# Altium schematic sheet LevelShift.SchDoc
size A; SheetNumber: 2; SheetTotal: 1
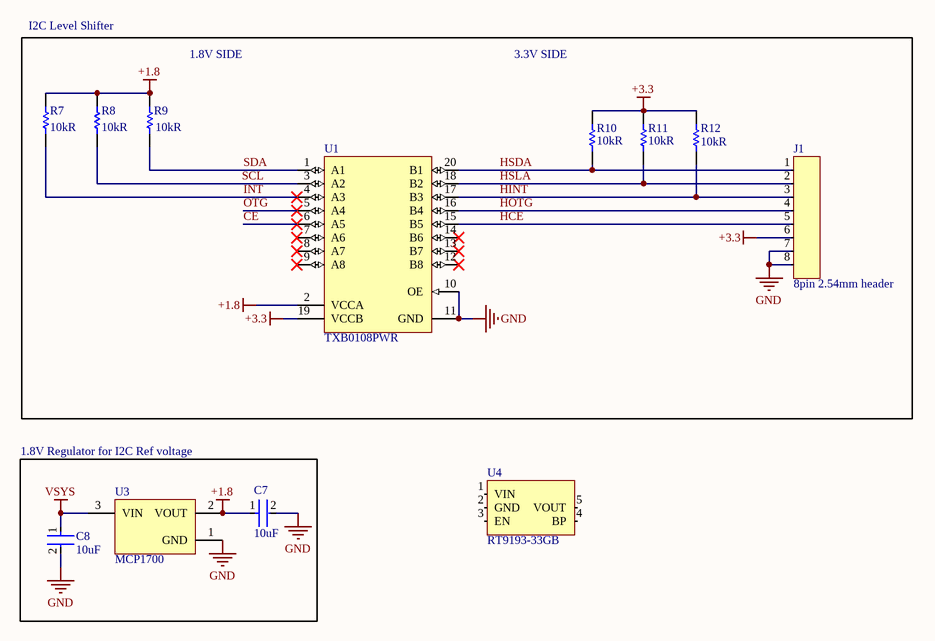
[diagram p0: LevelShift.SchDoc]

## Parts
C7  value 10uF  [FP-C0805C-DG-MFG]  (hidden comment: C0805C106K8PACTU)
C8  value 10uF  [FP-C0805C-DG-MFG]  (hidden comment: C0805C106K8PACTU)
J1  8pin 2.54mm header  [8pin 2.54mm header]
R7  value 10kR  [RESC2013X60X35NL10T20]  (hidden comment: RC0805FR-0710KL)
R8  value 10kR  [RESC2013X60X35NL10T20]  (hidden comment: RC0805FR-0710KL)
R9  value 10kR  [RESC2013X60X35NL10T20]  (hidden comment: RC0805FR-0710KL)
R10  value 10kR  [RESC2013X60X35NL10T20]  (hidden comment: RC0805FR-0710KL)
R11  value 10kR  [RESC2013X60X35NL10T20]  (hidden comment: RC0805FR-0710KL)
R12  value 10kR  [RESC2013X60X35NL10T20]  (hidden comment: RC0805FR-0710KL)
U1  TXB0108PWR  [PW0020A_L]
U3  MCP1700  [MCP1700-18]
U4  RT9193-33GB  [SOT-23-5]

## Blocks framed on the sheet
1.8V Regulator for I2C Ref voltage: C7 C8 U3

## Nets
+1.8: C7.1 R7.1 R8.1 R9.1 U1.2(VCCA) U3.2(VOUT)
+3.3: J1.6 R10.1 R11.1 R12.1 U1.19(VCCB)
GND: C7.2 C8.2 J1.7 J1.8 U1.10(OE) U1.11(GND) U3.1(GND)
VSYS: C8.1 U3.3(VIN)
CE: U1.6(A5)
HCE: J1.5 U1.15(B5)
HINT: J1.3 R12.2 U1.17(B3)
HOTG: J1.4 U1.16(B4)
HSDA: J1.1 R10.2 U1.20(B1)
HSLA: J1.2 R11.2 U1.18(B2)
INT: R7.2 U1.4(A3)
OTG: U1.5(A4)
SCL: R8.2 U1.3(A2)
SDA: R9.2 U1.1(A1)

Not connected (* = marked no-connect by the designer): U1 7(A6)* 8(A7)* 9(A8)* 12(B8)* 13(B7)* 14(B6)*; U4 1(VIN) 2(GND) 3(EN) 4(BP) 5(VOUT)

## Notes on the sheet
- I2C Level Shifter
- 1.8V SIDE
- 3.3V SIDE

## Library data of the parts
C7 C8 = CMP-2007-03243-2: CAP CER 10UF 10V X5R 0805; Manufacturer: Kemet; 3DS Part Number: 220-00001; Tolerance: 10%; Description: SMD Comm X5R, Ceramic, 10 uF, 10%, 10 V, X5R, SMD, MLCC, Temperature Stable, Class II, 0805; Temperature Coefficient: 15%; Material: Ceramic; Device Class L2: Capacitors; Device Class L1: Passive Components; ComponentLink2URL: https://content.kemet.com/datasheets/KEM_C1006_X5R_SMD.pdf; Height: 1.4mm; Lead Free: Yes; Manufacturer Part Number: C0805C106K8PACTU; Digikey Description: CAP CER 10UF 10V X5R 0805; Octopart: https://octopart.com/c0805c106k8pactu-kemet-98697; Capacitance: 10uF; Temperature Range Low: -55°C; Temperature: -55°C to +85°C; Automotive: No; Mouser Description: CAP CER 10UF 10V X5R 0805; Ipc Land Pattern Name: CAPC200125X125; Temperature Range High: +85°C; Voltage: 10V; RoHS: TRUE; Device Class L3: Ceramic Capacitors; ComponentLink2Description: Datasheet; Voltage Rating: 10V; Package: C0805C-DG; Temperature Characteristic: X5R; Category: Cap; LCSC: C15850
R7-R12 = CMP-1659-00013-4: Chip Resistor, 10 KOhm, +/- 1%, 0.125 W, -55 to 155 degC, 0805 (2012 Metric), RoHS, Tape and Reel; Manufacturer: Yageo; Voltage Rating: 150 V; Mount: Surface Mount; ComponentLink1Description: Manufacturer URL; ComponentLink2URL: http://www.yageo.com/documents/recent/PYu-RC_Group_51_RoHS_L_04.pdf; Pins: 2; Length: 2 mm; Min Operating Temperature: -55 degC; Height: 0.5 mm; Mounting Technology: Surface Mount; RoHSCompliant: true; REACH SVHC: No SVHC; ComponentLink1URL: http://www.yageo.com/; Max Operating Temperature: 155 degC; PackageReference: 0805; DatasheetVersion: Rev. 4, 02/2016; Package Quantity: 5000; ComponentLink2Description: Datasheet; PackageDescription: 2-Pin Surface Mounted Device, Body 2 x 1.25 mm; LCSC: C84376
U1 = CMP-2000-07337-1: TXB0108 8-Bit Bidirectional Voltage-Level Translator with Auto-Direction Sensing and / +/- 15-kV ESD Protection, 1.2 to 3.6 V, -40 to 85 degC, 20-Pin TSSOP (PW), Green (RoHS & no Sb/Br), Tape and Reel; Manufacturer: Texas Instruments; Propagation Delay (Max): 4ns; Logic Function: Translator,Bidirectional; Input Type: Logic; Package Version: 4040064-5/G, 02/2011; Voltage - Supply: 1.2V~3.6V,1.65V~5.5V; Data Rate: 100Mbps; Other Names: 296-21527-6; Number of Channels: 8; Differential - Input: Output:No/No; Number of Outputs/Channel: 1; Product Training Modules: VoltageLevelTranslation; Dynamic Catalog: TXBSeries; Package Reference: PW20; Package Description: 20-Pin Small Outline Package Integrated Circuit, Body 6.5 x 4.4 mm, Pitch 0.65 mm; Category: IntegratedCircuits(ICs); Datasheet URL: http://www.ti.com/general/docs/lit/getliterature.tsp?genericPartNumber=TXB0108&fileType=pdf; Package / Case: 20-TSSOP(0.173",4.40mmWidth); Family: Logic-Translators; Standard Package: 1; Series: -; Manufacturer URL: http://www.ti.com/; Number of Bits: 8; Package URL: http://www.ti.com/litv/pdf/mpds362; Output Type: Logic; Datasheet Version: Rev. F, 12/2014; Packaging: Digi-Reel®; Operating Temperature: -40°C~85°C; Supplier Device Package: 20-TSSOP; Mounting Technology: SurfaceMount; LCSC: C53406
U3 = MCP1700: Fixed Positive LDO Regulator, 1.8V, 0.35V Dropout, CMOS, PDSO3; Manufacturer: Microchip; Manufacturer Part Number: MCP1700T-1802E/TT; Package Body Material: Plastic; Dropout Voltage1-Max: 350mV; Dropout Voltage1-Nom: 150mV; Input Voltage Absolute-Max: 6.5V; Max Supply Voltage: 6V; Min Input Voltage: 2.3V; Channels: 1; Output Current1-Max: 200mA; Output Voltage1-Max: 1.854V; Output Voltage1-Min: 1.746V; Package Equivalence Code: TO-243; Regulator Type: FIXED POSITIVE SINGLE OUTPUT LDO REGULATOR; Time @ Peak Reflow Temperature-Max (s): 40s; Voltage Tolerance-Max: 3%; Qualification Status: Not Qualified; Supplier: Arrow Electronics; Supplier Part Number: MCP1700T-1802E/TT; RoHS: Yes; Category: Voltage Regulators - Linear; Stock: 12000; Pricing: 3000=0.381 (USD); Case/Package: TSOP; Pins: 3; Package Shape: Rectangular; Terminal Finish: Tin; JESD-609 Code: e3; Adjustability: FIXED; JESD-30 Code: R-PDSO-G3; Moisture Sensitivity Level: 1; Number of Outputs: 1; Operating Temperature, TJ-Max: 125°C; Operating Temperature, TJ-Min: -40°C; Output Voltage1-Nom: 1.8V; Packaging: Tape and Reel; Peak Reflow Temperature (Cel): 260°C; Surface Mount: Yes; Technology: CMOS; Terminal Form: Gull Wing; Terminal Position: DUAL; Length: 2.92mm; Width: 1.3mm; Height - Seated (Max): 1.12mm; Terminal Pitch: 0.95mm; Reach SVHC Compliant: Yes; RoHS Compliant: Yes; ComponentLink1URL: https://datasheet.ciiva.com:443/pdfs/VipMasterIC/IC/MCHP/MCHP-S-A0006757370/MCHP-S-A0006757370-1.pdf?src-supplier=IHS+Markit; ComponentLink1Description: https://datasheet.ciiva.com:443/pdfs/VipMasterIC/IC/MCHP/MCHP-S-A0006757370/MCHP-S-A0006757370-1.pdf?src-supplier=IHS+Markit; LCSC: C150796